# Altium schematic sheet Processor.SchDoc
size A
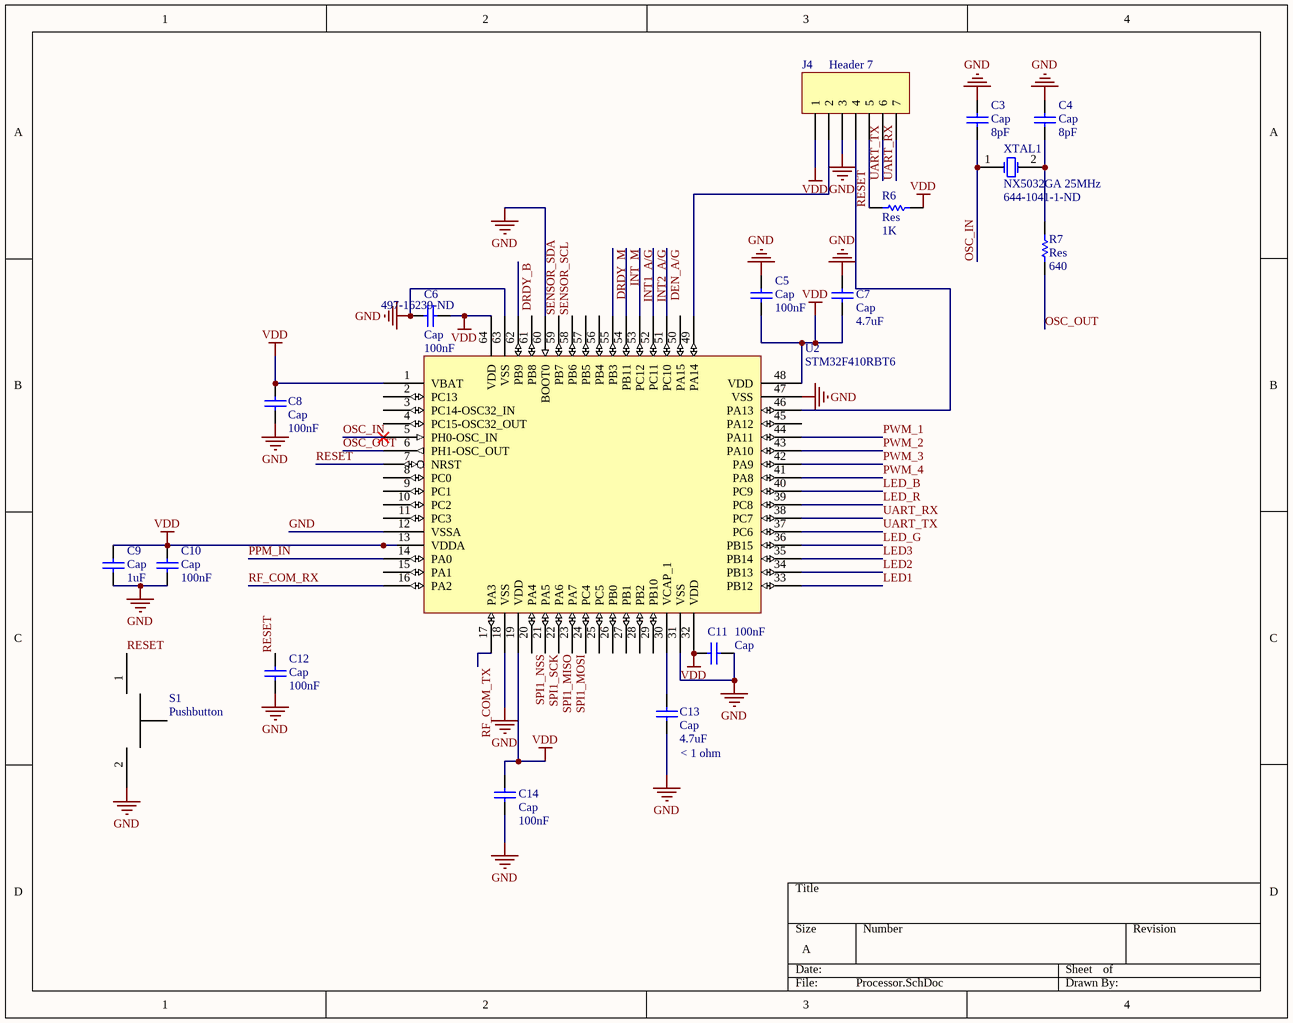
[diagram p0: Processor.SchDoc]

## Parts
C3  Cap  value 8pF  [C0805]
C4  Cap  value 8pF  [C0805]
C5  Cap  value 100nF  [C0805]
C6  Cap  value 100nF  [C0805]
C7  Cap  value 4.7uF  [C0805]
C8  Cap  value 100nF  [C0805]
C9  Cap  value 1uF  [C0805]
C10  Cap  value 100nF  [C0805]
C11  Cap  value 100nF  [C0805]
C12  Cap  value 100nF  [C0805]
C13  Cap  value 4.7uF  ESR: < 1 ohm  [C0805]
C14  Cap  value 100nF  [C0805]
J4  Header 7  [HDR1X7]
R6  Res  value 1K  [3216[1206]]
R7  Res  value 640  [3216[1206]]
S1  Pushbutton  [TactileSwitch]
U2  STM32F410RBT6  Supplier Part Number 1: 497-16239-ND  [LQFP-64 10x10mm]
XTAL1  NX5032GA 25MHz  Supplier Part Number 1: 644-1041-1-ND  [NX5032GA]

## Nets
GND: C3.1 C4.1 C5.2 C6.1 C7.2 C8.2 C9.2 C10.2 C11.2 C12.2 C13.1 C14.1 J4.3 S1.2 U2.12(VSSA) U2.18(VSS) U2.31(VSS) U2.47(VSS) U2.60(BOOT0) U2.63(VSS)
VDD: C5.1 C6.2 C7.1 C8.1 C9.1 C10.1 C11.1 C14.2 J4.1 R6.2 U2.1(VBAT) U2.13(VDDA) U2.19(VDD) U2.32(VDD) U2.48(VDD) U2.64(VDD)
DEN_A/G: U2.51(PC10)
DRDY_B: U2.62(PB9)
DRDY_M: U2.55(PB3)
INT1_A/G: U2.53(PC12)
INT2_A/G: U2.52(PC11)
INT_M: U2.54(PB11)
LED1: U2.33(PB12)
LED2: U2.34(PB13)
LED3: U2.35(PB14)
LED_B: U2.40(PC9)
LED_G: U2.36(PB15)
LED_R: U2.39(PC8)
OSC_IN: C3.2 U2.5(PH0-OSC_IN) XTAL1.1(OSC1)
OSC_OUT: R7.1 U2.6(PH1-OSC_OUT)
PPM_IN: U2.14(PA0)
PWM_1: U2.44(PA11)
PWM_2: U2.43(PA10)
PWM_3: U2.42(PA9)
PWM_4: U2.41(PA8)
RESET: C12.1 J4.5 R6.1 S1.1 U2.7(NRST)
RF_COM_RX: U2.16(PA2)
RF_COM_TX: U2.17(PA3)
SENSOR_SCL: U2.58(PB6)
SENSOR_SDA: U2.59(PB7)
SPI1_MISO: U2.22(PA6)
SPI1_MOSI: U2.23(PA7)
SPI1_NSS: U2.20(PA4)
SPI1_SCK: U2.21(PA5)
UART_RX: J4.7 U2.38(PC7)
UART_TX: J4.6 U2.37(PC6)
NetC4_2: C4.2 R7.2 XTAL1.2(OSC2)
NetC13_2: C13.2 U2.30(VCAP_1)
NetJ4_2: J4.2 U2.49(PA14)
NetJ4_4: J4.4 U2.46(PA13)

Not connected (* = marked no-connect by the designer): U2 2(PC13) 3(PC14-OSC32_IN) 4(PC15-OSC32_OUT) 8(PC0) 9(PC1) 10(PC2) 11(PC3) 15(PA1) 24(PC4) 25(PC5) 26(PB0) 27(PB1) 28(PB2) 29(PB10) 45(PA12) 50(PA15) 56(PB4) 57(PB5) 61(PB8)

## Library data of the parts
C3-C14 = Cap: Capacitor; Published: 8-Jun-2000; LatestRevisionDate: 17-Jul-2002; LatestRevisionNote: Re-released for DXP Platform.; PackageReference: C1206; Publisher: Altium Limited
J4 = Header 7: Header, 7-Pin; LatestRevisionDate: 17-Jul-2002; LatestRevisionNote: Re-released for DXP Platform.; Publisher: Altium Limited
R6 R7 = Res: Surface Mount Resistor; Published: 8-Jun-2000; LatestRevisionDate: 17-Jul-2002; LatestRevisionNote: Re-released for DXP Platform.; PackageReference: AXIAL-0.5; Publisher: Altium Limited
U2 = STM32F410RB_PINOUT: 64-LQFP - Pinout Representation; Manufacturer: STMicroelectronics; Frequency: 100; Interface: I2C,SPI,IrDA,UART,USART,LIN; Number of I/Os: 50; Oscillator Type: Internal; RAM Size: 32; Min Supply Voltage: 1.7; Max Supply Voltage: 3.6; Memory Type: FLASH; Memory Size: 128; Peripherals: Brown-out Detect/Reset,POR,PWM,WDT,DMA; Supplier 1: Digikey; Manufacturer Part Number: STM32F410RBT6; Pricing 2: 1=4.4, 10=3.951, 100=3.237, 500=2.7556, 1000=2.324 (USD); Case/Package: LQFP; Number of Pins: 64; Min Operating Temperature: -40; Max Operating Temperature: 85; Packaging: Tray; REACH SVHC: No SVHC; Lead Free: Lead Free; ComponentLink1URL: http://www.farnell.com/datasheets/2006536.pdf; ComponentLink1Description: http://www.farnell.com/datasheets/2006536.pdf
XTAL1 = NX5032GA: Manufacturer: Nihon Dempa Kogyo (NDK); Manufacturer Part Number: NX5032GA-25.000000MHZ-LN-CD-1; Frequency: 25; Frequency Tolerance: 50; Load Capacitance: 8; ESR (Equivalent Series Resistance): 70; Supplier 1: Digikey; Stock 1: 128038; Pricing 1: 1=0.66, 10=0.55, 50=0.495, 100=0.44, 500=0.418 (USD); Case/Package: SMD/SMT; Number of Pins: 2; Min Operating Temperature: -10; Max Operating Temperature: 70; Packaging: Tape and Reel; Frequency Stability: 50; Package Quantity: 1000; Length: 0.197; Height: 0.059; Width: 0.126; ComponentLink1URL: https://datasheet.ciiva.com/856/nx5032ga-856797.pdf; ComponentLink1Description: https://datasheet.ciiva.com/856/nx5032ga-856797.pdf; ComponentLink2URL: https://datasheet.ciiva.com/856/nx5032ga-856798.pdf; ComponentLink2Description: https://datasheet.ciiva.com/856/nx5032ga-856798.pdf; ComponentLink3URL: https://datasheet.ciiva.com/856/nx5032ga-856799.pdf; ComponentLink3Description: https://datasheet.ciiva.com/856/nx5032ga-856799.pdf